# Altium schematic sheet Sheet1.SchDoc
size A
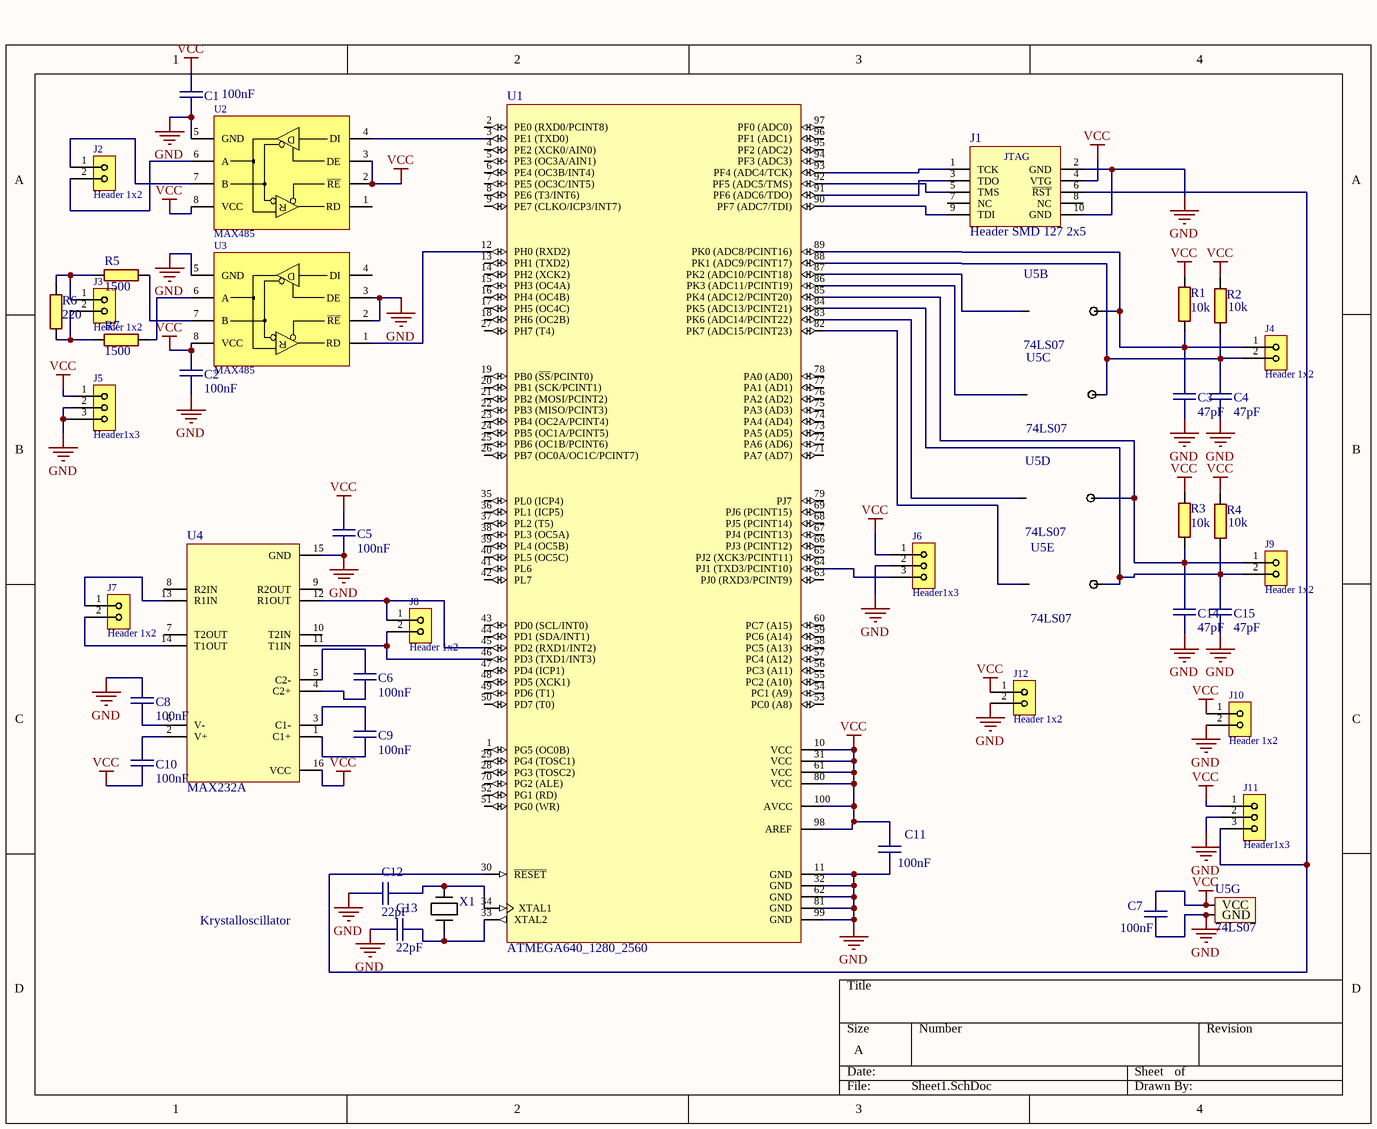
[diagram p0: Sheet1.SchDoc]

## Parts
C1  100nF  [CAPAR500W50L730T250H650]
C2  100nF  [CAPAR500W50L730T250H650]
C3  47pF  [CAPAR500W50L730T250H650]
C4  47pF  [CAPAR500W50L730T250H650]
C5  100nF  [CAPAR500W50L730T250H650]
C6  100nF  [CAPAR500W50L730T250H650]
C7  100nF  [CAPAR500W50L730T250H650]
C8  100nF  [CAPAR500W50L730T250H650]
C9  100nF  [CAPAR500W50L730T250H650]
C10  100nF  [CAPAR500W50L730T250H650]
C11  100nF  [CAPAR500W50L730T250H650]
C12  22pF  [CAPAR500W50L730T250H650]
C13  22pF  [CAPAR500W50L730T250H650]
C14  47pF  [CAPAR500W50L730T250H650]
C15  47pF  [CAPAR500W50L730T250H650]
J1  Header SMD 127 2x5  [SMDHDRV10P127_2X5_615X330X560B]
J2  Header 1x2  [HDRV2W64P254_1X2_508X254X900B]
J3  Header 1x2  [HDRV2W64P254_1X2_508X254X900B]
J4  Header 1x2  [HDRV2W64P254_1X2_508X254X900B]
J5  Header1x3  [HDRV3W64P254_1X3_762X254X900B]
J6  Header1x3  [HDRV3W64P254_1X3_762X254X900B]
J7  Header 1x2  [HDRV2W64P254_1X2_508X254X900B]
J8  Header 1x2  [HDRV2W64P254_1X2_508X254X900B]
J9  Header 1x2  [HDRV2W64P254_1X2_508X254X900B]
J10  Header 1x2  [HDRV2W64P254_1X2_508X254X900B]
J11  Header1x3  [HDRV3W64P254_1X3_762X254X900B]
J12  Header 1x2  [HDRV2W64P254_1X2_508X254X900B]
R1  10k  [RESA_0.25W]
R2  10k  [RESA_0.25W]
R3  10k  [RESA_0.25W]
R4  10k  [RESA_0.25W]
R5  1500  [RESA_0.25W]
R6  220  [RESA_0.25W]
R7  1500  [RESA_0.25W]
U1  ATMEGA640_1280_2560  [TQFP100_M]
U2  MAX485  [DIP-8]
U3  MAX485  [DIP-8]
U4  MAX232A  [CircuitWorks-DIP16]
U5  74LS07  [DIP14]  (parts B,C,D,E,G of 7)
X1  Krystalloscillator  [CrystalTH]

## Nets
GND: C1.1 C2.1 C3.1 C4.1 C5.1 C7.1 C8.2 C11.1 C12.2 C13.2 C14.1 C15.1 J1.2(GND) J1.10(GND) J5.2 J5.3 J6.2 J10.2 J11.2 J12.2 U1.11(GND) U1.32(GND) U1.62(GND) U1.81(GND) U1.99(GND) U2.5(GND) U3.2(~{RE}) U3.3(DE) U3.5(GND) U4.15(GND) U5.7(GND)
VCC: C1.2 C2.2 C5.2 C7.2 C10.1 C11.2 J1.4(VTG) J5.1 J6.1 J10.1 J11.1 J12.1 R1.2 R2.2 R3.2 R4.2 U1.10(VCC) U1.31(VCC) U1.61(VCC) U1.80(VCC) U1.98(AREF) U1.100(AVCC) U2.2(~{RE}) U2.3(DE) U2.8(VCC) U3.8(VCC) U4.16(VCC) U5.14(VCC)
NetC3_2: C3.2 J4.1 R1.1 U1.89(PK0_(ADC8/PCINT16)) U5.4(B_Out)
NetC4_2: C4.2 J4.2 R2.1 U1.88(PK1_(ADC9/PCINT17)) U5.6(C_Out)
NetC6_1: C6.1 U4.4(C2+)
NetC6_2: C6.2 U4.5(C2-)
NetC8_1: C8.1 U4.6(V-)
NetC9_1: C9.1 U4.1(C1+)
NetC9_2: C9.2 U4.3(C1-)
NetC10_2: C10.2 U4.2(V+)
NetC12_1: C12.1 U1.34(XTAL1) X1.1
NetC13_1: C13.1 U1.33(XTAL2) X1.2
NetC14_2: C14.2 J9.1 R3.1 U1.85(PK4_(ADC12/PCINT20)) U5.9(D_Out)
NetC15_2: C15.2 J9.2 R4.1 U1.84(PK5_(ADC13/PCINT21)) U5.11(E_Out)
NetJ1_1: J1.1(TCK) U1.93(PF4_(ADC4/TCK))
NetJ1_3: J1.3(TDO) U1.91(PF6_(ADC6/TDO))
NetJ1_5: J1.5(TMS) U1.92(PF5_(ADC5/TMS))
NetJ1_6: J1.6(~{RST}) J11.3 U1.30(~{RESET})
NetJ1_9: J1.9(TDI) U1.90(PF7_(ADC7/TDI))
NetJ2_1: J2.1 U2.7(B)
NetJ2_2: J2.2 U2.6(A)
NetJ3_1: J3.1 R5.2 R6.2
NetJ3_2: J3.2 R6.1 R7.2
NetJ6_3: J6.3 U1.64(PJ1_(TXD3/PCINT10))
NetJ7_1: J7.1 U4.13(R1IN)
NetJ7_2: J7.2 U4.14(T1OUT)
NetJ8_1: J8.1 U1.45(PD2_(RXD1/INT2)) U4.12(R1OUT)
NetJ8_2: J8.2 U1.46(PD3_(TXD1/INT3)) U4.11(T1IN)
NetR5_1: R5.1 U3.7(B)
NetR7_1: R7.1 U3.6(A)
NetU1_3: U1.3(PE1_(TXD0)) U2.4(DI)
NetU1_12: U1.12(PH0_(RXD2)) U3.1(RD)
NetU1_82: U1.82(PK7_(ADC15/PCINT23)) U5.10(E_In)
NetU1_83: U1.83(PK6_(ADC14/PCINT22)) U5.8(D_In)
NetU1_86: U1.86(PK3_(ADC11/PCINT19)) U5.5(C_In)
NetU1_87: U1.87(PK2_(ADC10/PCINT18)) U5.3(B_In)

Not connected (* = marked no-connect by the designer): J1 7(NC) 8(NC); U1 1(PG5_(OC0B)) 2(PE0_(RXD0/PCINT8)) 4(PE2_(XCK0/AIN0)) 5(PE3_(OC3A/AIN1)) 6(PE4_(OC3B/INT4)) 7(PE5_(OC3C/INT5)) 8(PE6_(T3/INT6)) 9(PE7_(CLKO/ICP3/INT7)) 13(PH1_(TXD2)) 14(PH2_(XCK2)) 15(PH3_(OC4A)) 16(PH4_(OC4B)) 17(PH5_(OC4C)) 18(PH6_(OC2B)) 19(PB0_(~{SS}/PCINT0)) 20(PB1_(SCK/PCINT1)) 21(PB2_(MOSI/PCINT2)) 22(PB3_(MISO/PCINT3)) 23(PB4_(OC2A/PCINT4)) 24(PB5_(OC1A/PCINT5)) 25(PB6_(OC1B/PCINT6)) 26(PB7_(OC0A/OC1C/PCINT7)) 27(PH7_(T4)) 28(PG3_(TOSC2)) 29(PG4_(TOSC1)) 35(PL0_(ICP4)) 36(PL1_(ICP5)) 37(PL2_(T5)) 38(PL3_(OC5A)) 39(PL4_(OC5B)) 40(PL5_(OC5C)) 41(PL6) 42(PL7) 43(PD0_(SCL/INT0)) 44(PD1_(SDA/INT1)) 47(PD4_(ICP1)) 48(PD5_(XCK1)) 49(PD6_(T1)) 50(PD7_(T0)) 51(PG0_(WR)) 52(PG1_(RD)) 53(PC0_(A8)) 54(PC1_(A9)) 55(PC2_(A10)) 56(PC3_(A11)) 57(PC4_(A12)) 58(PC5_(A13)) 59(PC6_(A14)) 60(PC7_(A15)) 63(PJ0_(RXD3/PCINT9)) 65(PJ2_(XCK3/PCINT11)) 66(PJ3_(PCINT12)) 67(PJ4_(PCINT13)) 68(PJ5_(PCINT14)) 69(PJ6_(PCINT15)) 70(PG2_(ALE)) 71(PA7_(AD7)) 72(PA6_(AD6)) 73(PA5_(AD5)) 74(PA4_(AD4)) 75(PA3_(AD3)) 76(PA2_(AD2)) 77(PA1_(AD1)) 78(PA0_(AD0)) 79(PJ7) 94(PF3_(ADC3)) 95(PF2_(ADC2)) 96(PF1_(ADC1)) 97(PF0_(ADC0)); U2 1(RD); U3 4(DI); U4 7(T2OUT) 8(R2IN) 9(R2OUT) 10(T2IN)

## Notes on the sheet
- (in symbol 3048) D; R

## Library data of the parts
C1-C15 = 3269: 100V plast; id: 3269; rad: 12; rom: OV; lager_type: Fremlager; dybde: 1; hylle: 4; antall: 200; kolonne: 0; pakke_opprettet_av: 1335; symbol_opprettet_av: 815; leverandor_varenr: 2525325; pris: 2; leverandor: Farnell; pakketype: TH; pakke_opprettet: 16.11.2016 21:11:30; symbol_opprettet: 14.11.2014 20:19:34
  C1 C2 C5-C11: navn: 100nF
  C3 C4 C14 C15: navn: 47pF
  C12 C13: navn: 22pF
J1 = 2449: id: 2449; rad: 4; rom: OV; lager_type: Fremlager; dybde: 0; hylle: 6; antall: 55; pakke_opprettet_av: 815; beskrivelse: 1,27mm Pitch SMD Header; pris: 20; nokkelord: JTAG; kolonne: 0; pakke_opprettet: 15.11.2014 18:30:38; symbol_opprettet_av: 815; symbol_opprettet: 15.11.2014 18:33:29; navn: Header SMD 127 2x5; pakketype: SMD
J2-J4 J7-J10 J12 = 2429: id: 2429; pakke_opprettet_av: 815; beskrivelse: 2,54mm pitch; pris: 1; pakketype: TH; pakke_opprettet: 13.11.2014 12:30:48; symbol_opprettet_av: 815; symbol_opprettet: 13.11.2014 10:58:53; navn: Header 1x2
J5 J6 J11 = 2430: id: 2430; pakke_opprettet_av: 815; beskrivelse: 2,54mm pitch; pris: 2; pakketype: TH; pakke_opprettet: 13.11.2014 12:31:03; symbol_opprettet_av: 815; symbol_opprettet: 13.11.2014 10:59:05; navn: Header 1x3
R1-R7 = 2807: 0.25W 1% Generic resistor; id: 2807; rad: 14; rom: GM; lager_type: Baklager; dybde: 16; hylle: 0; antall: 250; pakke_opprettet_av: 815; nokkelord: Motstand, Resistor; pakketype: TH; kolonne: 0; pakke_opprettet: 28.06.2014 17:13:33; symbol_opprettet_av: 815; symbol_opprettet: 08.07.2014 21:16:33; pris: 0
  R1-R4: navn: 10k
  R5 R7: navn: 1500
  R6: navn: 220
U2 U3 = 3048: 3.3V-Powered, 10Mbps and Slew-Rate-Limited True RS-485/RS-422 Transceivers; rad: 4; rom: OV; lager_type: Fremlager; dybde: 0; hylle: 2; antall: 40; pakke_opprettet_av: 815; pris: 22; nokkelord: RS485; pakketype: SOIC; produsent: Exar; id: 3048; leverandor_varenr: 1296640; leverandor: Farnell; navn: MAX485; kolonne: 4; pakke_opprettet: 28.06.2014 18:39:37; symbol_opprettet_av: 815; symbol_opprettet: 07.05.2015 21:29:51
U4 = 2080: rs232 -> ttl converter; id: 2080; pakke_opprettet_av: 1607; symbol_opprettet_av: 1154; pris: 5; pakketype: DIP; pakke_opprettet: 25.08.2016 00:00:22; symbol_opprettet: 14.09.2016 15:58:47; navn: MAX232A
U5 = 74LS04
X1 = 3915: 4MHz; id: 3915; rad: 0; rom: OV; lager_type: Fremlager; hylle: 7; antall: 30; pakke_opprettet_av: 1150; symbol_opprettet_av: 774; pris: 2; nokkelord: krystall, crystal, oscillator; pakketype: TH; dybde: 0; pakke_opprettet: 29.01.2017 21:01:52; symbol_opprettet: 23.08.2014 20:23:20; navn: Krystalloscillator